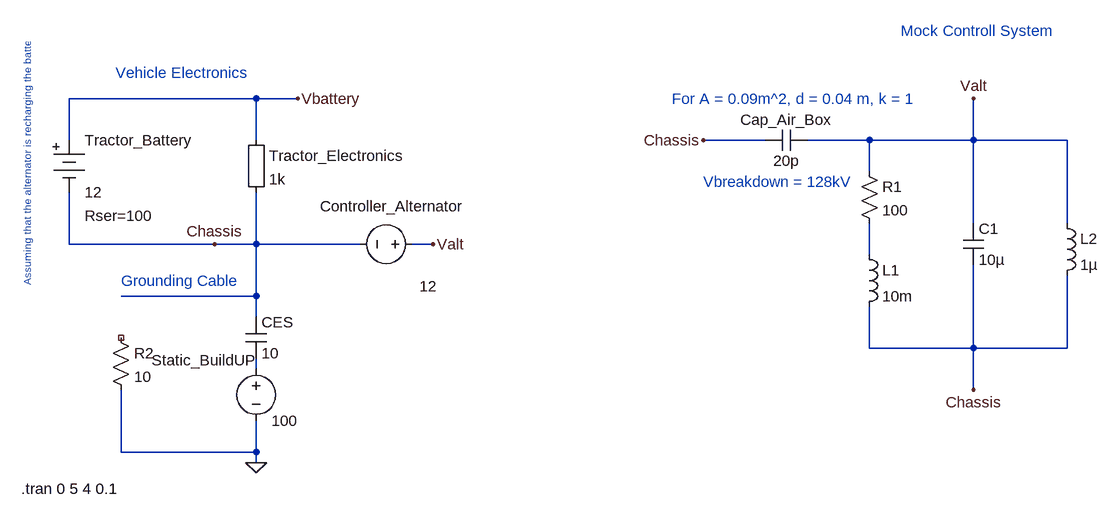
[diagram p0: schematic Chassis_Static_Charge_Effect_Design.asc]
Chassis_Static_Charge_Effect_Design.asc, the LTspice schematic file:
Version 4
SHEET 1 1176 980
WIRE -128 -96 -416 -96
WIRE -64 -96 -128 -96
WIRE -416 -32 -416 -96
WIRE -128 -32 -128 -96
WIRE 656 -32 560 -32
WIRE 816 -32 720 -32
WIRE 976 -32 976 -96
WIRE 976 -32 816 -32
WIRE 1120 -32 976 -32
WIRE 816 16 816 -32
WIRE 976 96 976 -32
WIRE 1120 96 1120 -32
WIRE -416 128 -416 48
WIRE -192 128 -416 128
WIRE -128 128 -128 48
WIRE -128 128 -192 128
WIRE 32 128 -128 128
WIRE 144 128 112 128
WIRE 816 144 816 96
WIRE -128 208 -128 128
WIRE -128 208 -336 208
WIRE -128 240 -128 208
WIRE 816 288 816 224
WIRE 976 288 976 160
WIRE 976 288 816 288
WIRE 1120 288 1120 176
WIRE 1120 288 976 288
WIRE -128 320 -128 304
WIRE 976 352 976 288
WIRE -336 448 -336 352
WIRE -128 448 -128 400
WIRE -128 448 -336 448
WIRE -128 464 -128 448
FLAG -64 -96 Vbattery
FLAG 144 128 Valt
FLAG -128 464 0
FLAG -192 128 Chassis
FLAG 976 -96 Valt
FLAG 976 352 Chassis
FLAG 560 -32 Chassis
SYMBOL Misc\\battery -416 -48 R0
WINDOW 123 0 0 Left 2
WINDOW 39 24 132 Left 2
SYMATTR InstName Tractor_Battery
SYMATTR Value 12
SYMATTR SpiceLine Rser=100
SYMBOL Misc\\EuropeanResistor -144 -48 R0
SYMATTR InstName Tractor_Electronics
SYMATTR Value 1k
SYMBOL voltage 128 128 R90
WINDOW 0 -58 -66 VRight 2
WINDOW 3 65 -22 VRight 2
WINDOW 123 0 0 Left 2
WINDOW 39 0 0 Left 2
SYMATTR InstName Controller_Alternator
SYMATTR Value 12
SYMBOL voltage -128 304 R0
WINDOW 0 -161 3 Left 2
WINDOW 123 0 0 Left 2
WINDOW 39 0 0 Left 2
SYMATTR InstName Static_BuildUP
SYMATTR Value 100
SYMBOL cap -144 240 R0
SYMATTR InstName CES
SYMATTR Value 10
SYMATTR SpiceLine V=100
SYMBOL ind 800 128 R0
SYMATTR InstName L1
SYMATTR Value 10m
SYMBOL res 800 0 R0
SYMATTR InstName R1
SYMATTR Value 100
SYMBOL cap 960 96 R0
SYMATTR InstName C1
SYMATTR Value 10µ
SYMBOL ind 1104 80 R0
SYMATTR InstName L2
SYMATTR Value 1µ
SYMBOL res -352 256 R0
SYMATTR InstName R2
SYMATTR Value 10
SYMBOL cap 720 -48 R90
WINDOW 0 0 32 VBottom 2
WINDOW 3 32 32 VTop 2
SYMATTR InstName Cap_Air_Box
SYMATTR Value 20p
SYMATTR SpiceLine V=128000
TEXT -344 -136 Left 2 ;Vehicle Electronics
TEXT -480 192 VLeft 1 ;Assuming that the alternator is recharging the batter
TEXT 864 -200 Left 2 ;Mock Controll System
TEXT 512 -96 Left 2 ;For A = 0.09m^2, d = 0.04 m, k = 1
TEXT 560 32 Left 2 ;Vbreakdown = 128kV
TEXT -490 504 Left 2 !.tran 0 5 4 0.1
TEXT -336 184 Left 2 ;Grounding Cable

The netlist it stands for:
* Chassis_Static_Charge_Effect_Design.asc
V§Tractor_Battery Vbattery Chassis 12 Rser=100
R§Tractor_Electronics Vbattery Chassis 1k
V§Controller_Alternator Valt Chassis 12
V§Static_BuildUP N002 0 100
CES Chassis N002 10 V=100
L1 N001 Chassis 10m
R1 Valt N001 100
C1 Valt Chassis 10µ
L2 Valt Chassis 1µ
R2 NC_01 0 10
Cap_Air_Box Valt Chassis 20p V=128000
* Vehicle Electronics
* Assuming that the alternator is recharging the batter
* Mock Controll System
* For A = 0.09m^2, d = 0.04 m, k = 1
* Vbreakdown = 128kV
.tran 0 5 4 0.1
* Grounding Cable
.backanno
.end